# EasyEDA Pro project ProDoc_P1_2026-05-19.epro

# Schematic Schematic1
Assembly Variant: Basic; Board Name: Schematic1; Create Date: 2026-05-19; Page Name: P1; Project Name: STDRIVE101_3Phase_Inverter; Schematic Name: Schematic1; Update Date: 2026-05-19; BladeWidth: 10; Company: 嘉立创EDA; Page Size: A4; RegionStart: 1; ShowBorder: 1; TitleBlock: 0; TitleBlockPosition: 3; Version: V1.0; XRegionCount: 6; YRegionCount: 4
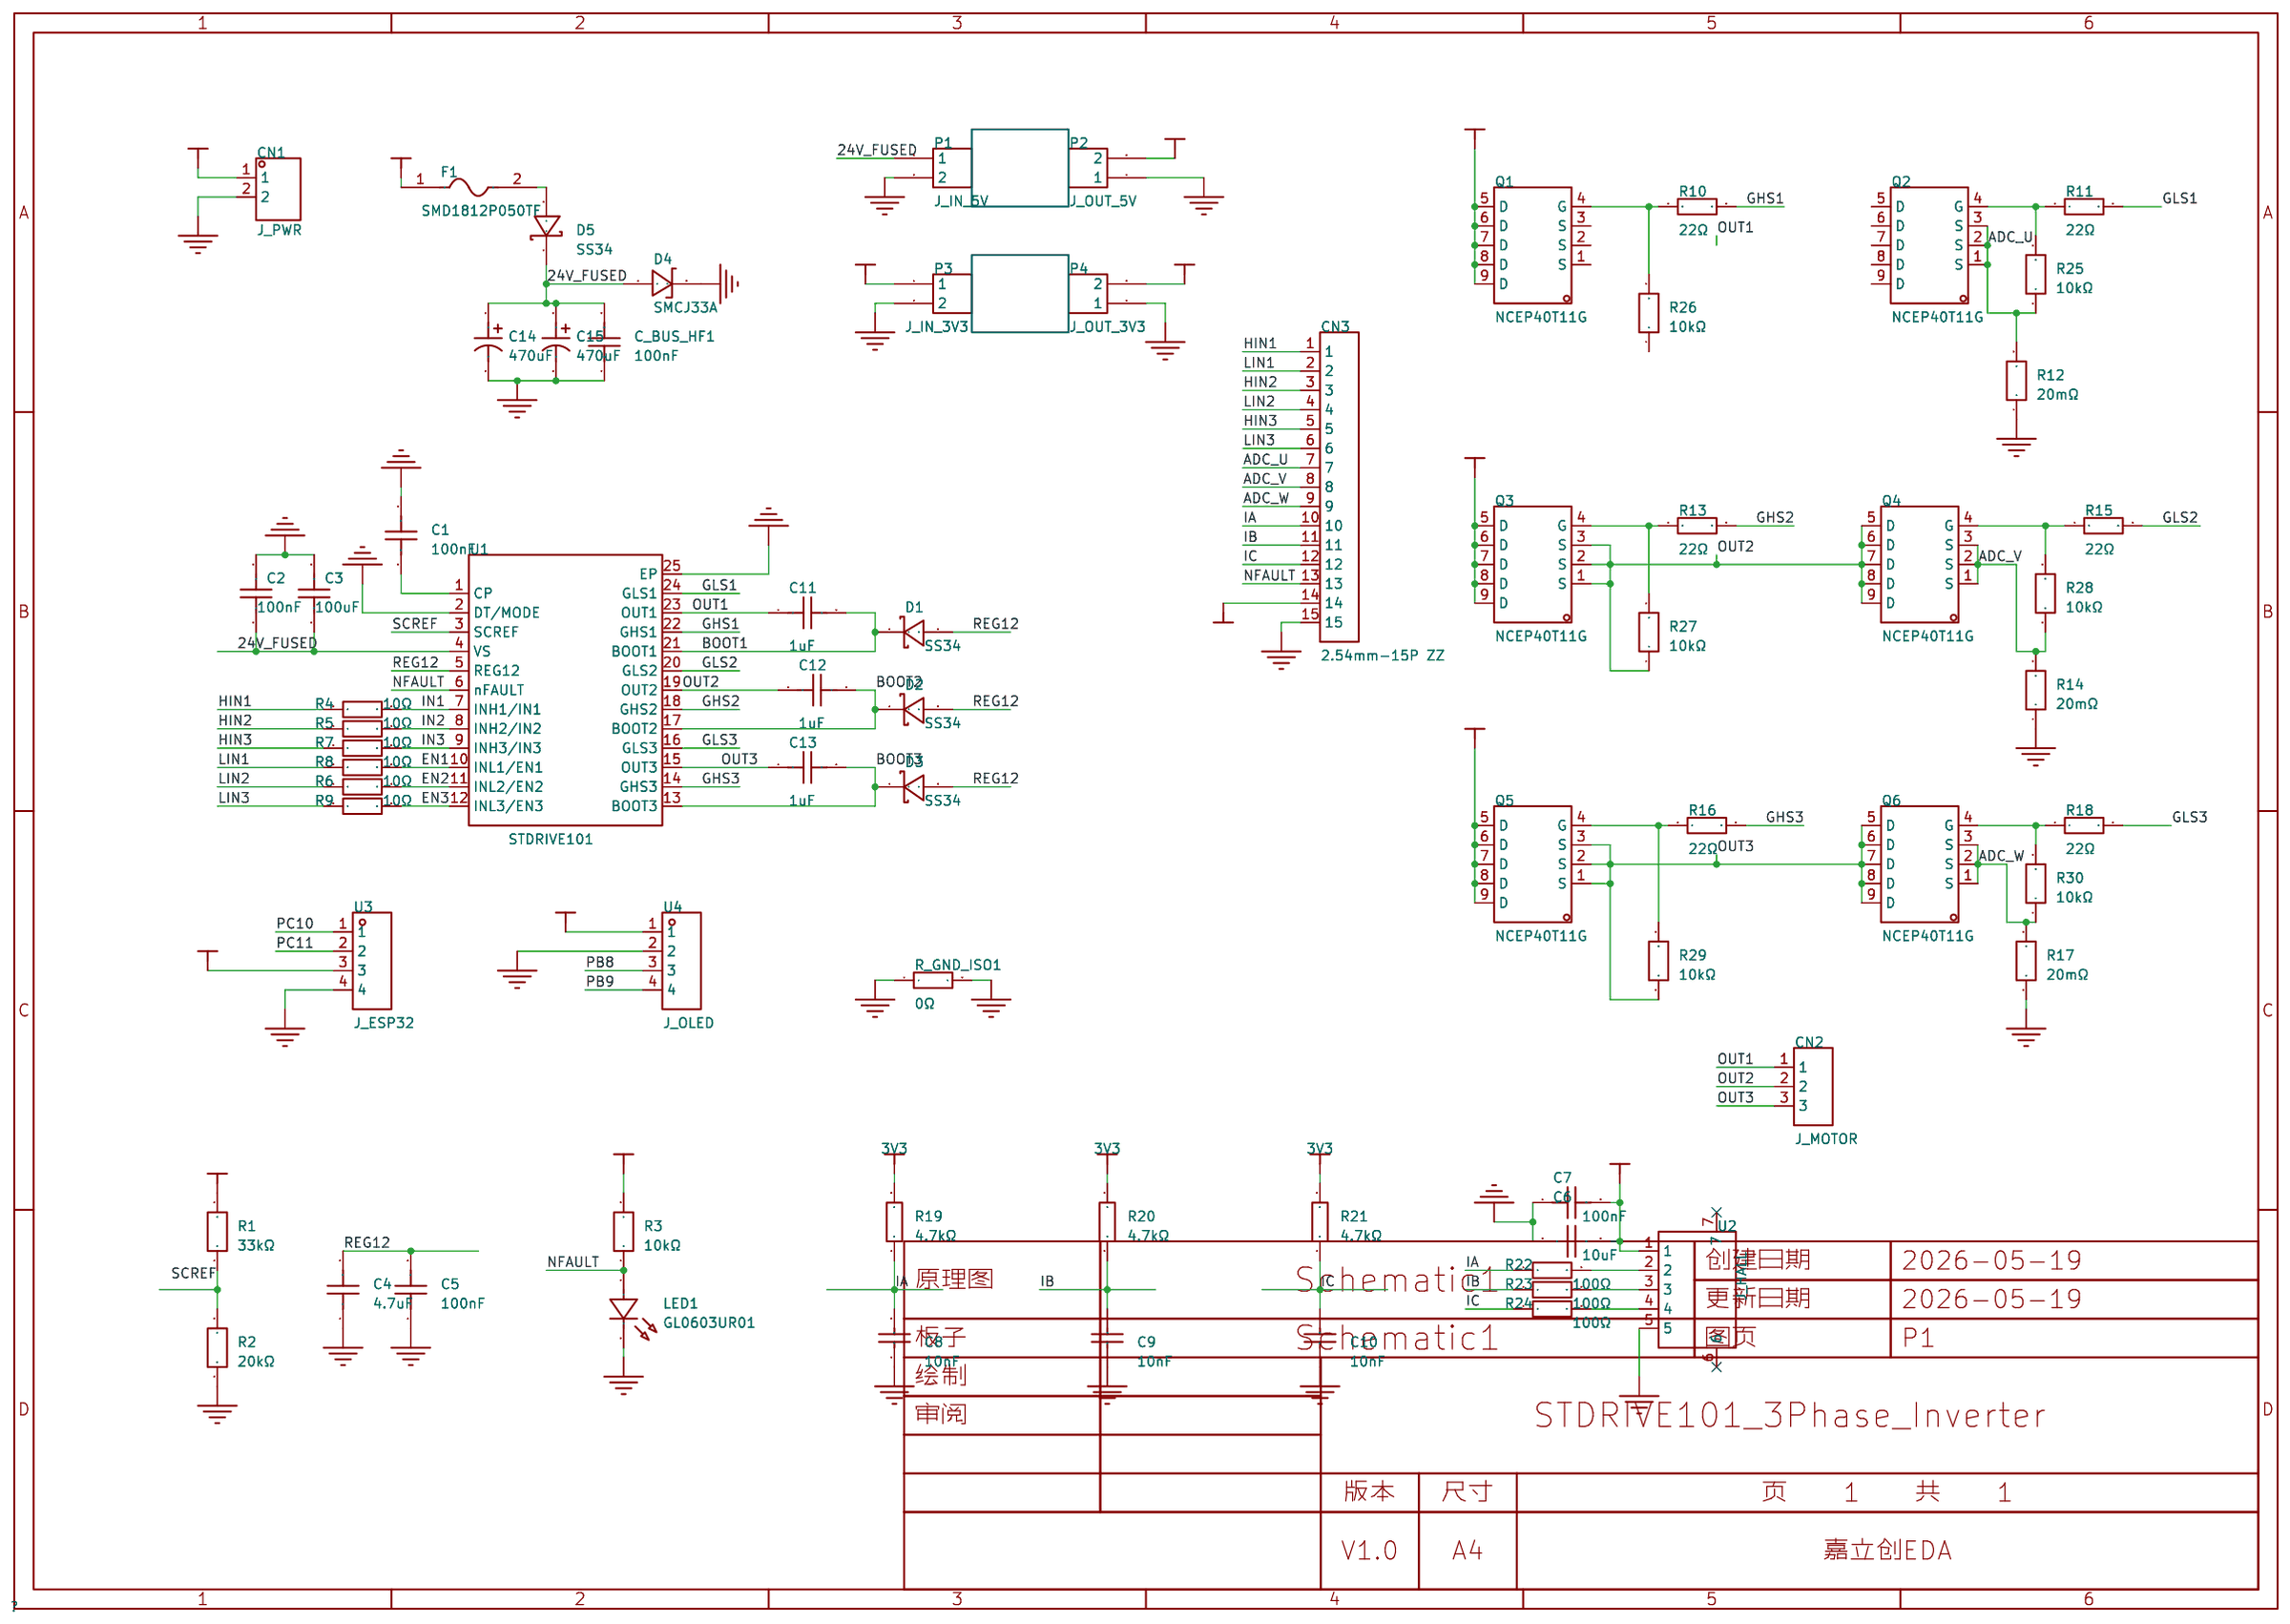
[diagram p0: schematic sheet]

## Parts
C1  100nF  [C0603]
C2  100nF  [C0603]
C3  100uF  [C0603]
C4  4.7uF  [C0603]
C5  100nF  [C0603]
C6  10uF  [C0603]
C7  100nF  [C0603]
C8  10nF  [C0603]
C9  10nF  [C0603]
C10  10nF  [C0603]
C11  1uF  [C0603]
C12  1uF  [C0603]
C13  1uF  [C0603]
C14  470uF  [CAP-TH_BD10.0-P5.00-D0.6-FD-A]
C15  470uF  [CAP-TH_BD10.0-P5.00-D0.6-FD-A]
C_BUS_HF1  100nF  [C0603]
CN1  J_PWR  [CONN-TH_2P-P5.08_LZ1V-5.08-5P-140-00A]
CN2  J_MOTOR  [CONN-TH_3P-MX128-5.08-GN01-03P-CU-Y-A]
CN3  2.54mm-15P ZZ  [CONN-TH_15P-P2.50_HX-2.54MM-15P-ZZ]
D1  SS34  [SMA_L4.3-W2.6-LS5.2-RD]
D2  SS34  [SMA_L4.3-W2.6-LS5.2-RD]
D3  SS34  [SMA_L4.3-W2.6-LS5.2-RD]
D4  SMCJ33A  [SMC_L7.1-W6.2-LS8.1-FD]
D5  SS34  [SMA_L4.3-W2.6-LS5.2-RD]
F1  SMD1812P050TF  [F1812]
LED1  GL0603UR01  [LED0603-FD]
P1  J_IN_5V  [HDR-TH_2P-P2.54-V-M]
P2  J_OUT_5V  [HDR-TH_2P-P2.54-V-M]
P3  J_IN_3V3  [HDR-TH_2P-P2.54-V-M]
P4  J_OUT_3V3  [HDR-TH_2P-P2.54-V-M]
Q1  NCEP40T11G  [DFN-8_L5.1-W5.7-P1.27-LS6.1-BL]
Q2  NCEP40T11G  [DFN-8_L5.1-W5.7-P1.27-LS6.1-BL]
Q3  NCEP40T11G  [DFN-8_L5.1-W5.7-P1.27-LS6.1-BL]
Q4  NCEP40T11G  [DFN-8_L5.1-W5.7-P1.27-LS6.1-BL]
Q5  NCEP40T11G  [DFN-8_L5.1-W5.7-P1.27-LS6.1-BL]
Q6  NCEP40T11G  [DFN-8_L5.1-W5.7-P1.27-LS6.1-BL]
R1  33kΩ  [R0603]
R2  20kΩ  [R0603]
R3  10kΩ  [R0603]
R4  10Ω  [R0603]
R5  10Ω  [R0603]
R6  10Ω  [R0603]
R7  10Ω  [R0603]
R8  10Ω  [R0603]
R9  10Ω  [R0603]
R10  22Ω  [R0603]
R11  22Ω  [R0603]
R12  20mΩ  [R0603]
R13  22Ω  [R0603]
R14  20mΩ  [R0603]
R15  22Ω  [R0603]
R16  22Ω  [R0603]
R17  20mΩ  [R0603]
R18  22Ω  [R0603]
R19  4.7kΩ  [R0603]
R20  4.7kΩ  [R0603]
R21  4.7kΩ  [R0603]
R22  100Ω  [R0603]
R23  100Ω  [R0603]
R24  100Ω  [R0603]
R25  10kΩ  [R0603]
R26  10kΩ  [R0603]
R27  10kΩ  [R0603]
R28  10kΩ  [R0603]
R29  10kΩ  [R0603]
R30  10kΩ  [R0603]
R_GND_ISO1  0Ω  [R0603]
U1  STDRIVE101  [QFN-24_L4.0-W4.0-P0.50-BL-EP2.7]
U2  J_HALL  [CONN-SMD_5P-P2.54_XH2.54-5AB]
U3  J_ESP32  [HDR-TH_4P-P2.54-V-C4_TH-4_2.5X10.5X2.54P]
U4  J_OLED  [HDR-TH_4P-P2.54-V-C4_TH-4_2.5X10.5X2.54P]

## Library data of the parts
C1 C2 C5 C7 C_BUS_HF1 = CGA0603X7R104K500JT: 容值:100nF;精度:±10%;额定电压:50V;温度系数:X7R;; LCSC Part Name: 100nF ±10% 50V; Supplier Part: C6119867; Manufacturer: HRE(芯声); Supplier Footprint: 0603; JLCPCB Part Class: Extended Part; Datasheet: https://item.szlcsc.com/datasheet/CGA0603X7R104K500JT/7062573.html; Supplier: LCSC; Tolerance: ±10%; Voltage Rating: 50V; Temperature Coefficient: X7R
C3 C11-C13 = CAP_0603: Supplier Footprint: 0603
C4 = CGA0603X5R475K250JT: 容值:4.7uF;精度:±10%;额定电压:25V;温度系数:X5R;; LCSC Part Name: 4.7uF ±10% 25V; Supplier Part: C6119856; Manufacturer: HRE(芯声); Supplier Footprint: 0603; JLCPCB Part Class: Extended Part; Datasheet: https://item.szlcsc.com/datasheet/CGA0603X5R475K250JT/7062562.html; Supplier: LCSC; Tolerance: ±10%; Voltage Rating: 25V; Temperature Coefficient: X5R
C6 = CGA0603X5R106K100JT: 容值:10uF;精度:±10%;额定电压:10V;温度系数:X5R;; LCSC Part Name: 10uF ±10% 10V; Supplier Part: C6119842; Manufacturer: HRE(芯声); Supplier Footprint: 0603; JLCPCB Part Class: Extended Part; Datasheet: https://item.szlcsc.com/datasheet/CGA0603X5R106K100JT/7062548.html; Supplier: LCSC; Tolerance: ±10%; Voltage Rating: 10V; Temperature Coefficient: X5R
C8-C10 = CC0603KRX7R9BB103: 容值:10nF;精度:±10%;额定电压:50V;温度系数:X7R;; LCSC Part Name: 10nF ±10% 50V; Supplier Part: C100042; Manufacturer: YAGEO(国巨); Supplier Footprint: 0603; JLCPCB Part Class: Extended Part; Datasheet: https://item.szlcsc.com/datasheet/CC0603KRX7R9BB103/101256.html; Supplier: LCSC; Tolerance: ±10%; Voltage Rating: 50V; Temperature Coefficient: X7R
C14 C15 = PA63V470M10X17: 容值:470uF;精度:±20%;额定电压:63V;纹波电流:4.1A@100kHz;等效串联电阻(ESR):18mΩ@100kHz;类型:聚合物;; LCSC Part Name: 470uF ±20% 63V; Supplier Part: C49232909; Manufacturer: JIERR(捷而瑞); Supplier Footprint: 插件,D10xL17mm; JLCPCB Part Class: Extended Part; Datasheet: https://item.szlcsc.com/datasheet/PA63V470M10X17/51647988.html; Supplier: LCSC; Tolerance: ±20%; Voltage Rating: 63V; Ripple Current: 4.1A@100kHz; Equivalent Series Resistance(ESR): 18mΩ@100kHz; Type: 聚合物; Pin Spacing: 5mm; Diameter: 10mm; Height - Seated (Max): 17mm; Lifetime: 2000hrs@105℃; Operating Temperature: -55℃~+105℃
CN1 = LZ1V-5.08-5P-140-00A: Supplier Part: C9900004323; Supplier Footprint: TH-2_P=5.08mm; JLCPCB Part Class: Extended Part; Supplier: LCSC
CN2 = MX128-5.08-3P: Supplier Part: C9900216095; Supplier Footprint: 插件,P=5.08mm,3P; JLCPCB Part Class: Extended Part; Supplier: LCSC
CN3 = 2.54mm-15P ZZ: 插针结构:1x15P;间距:2.5mm;安装方式:直插;参考系列:XH;总PIN数:15P;排数:1;每排PIN数:15;行距:-;额定电流:3A;触头材质:黄铜;触头镀层:锡;工作温度:-25℃~+85℃;; LCSC Part Name: 2.54-15P直针 白色不耐温; Supplier Part: C5368787; Manufacturer: SHOU HAN(首韩); Supplier Footprint: 插件,P=2.5mm; JLCPCB Part Class: Extended Part; Datasheet: https://item.szlcsc.com/datasheet/2.54mm-15P%2520ZZ/6208429.html; Supplier: LCSC; Pins Structure: 1x15P; Pitch: 2.5mm; Mounting Type: 直插; Reference Series: XH; Number of Pins: 15P; Number of Rows: 1; Number of PINs Per Row: 15; Current Rating: 3A; Contact Material: 黄铜; Contact Plating: 锡; Operating Temperature: -25℃~+85℃; Voltage Rating: 250V; Plastic Material: PA66; Flame Retardant Rating: UL94V-0; Color: 白色
D1-D3 D5 = SS34_C8678: 二极管配置:独立式;正向压降(Vf):550mV@3A;直流反向耐压(Vr):40V;整流电流:3A;; LCSC Part Name: 电压:40V 电流:3A; Supplier Part: C8678; Manufacturer: MDD(辰达半导体); Supplier Footprint: SMA(DO-214AC); JLCPCB Part Class: Basic Part; Datasheet: https://item.szlcsc.com/datasheet/SS34/9178.html; Supplier: LCSC; Diode Configuration: 独立式; Voltage - Forward(Vf@If): 550mV@3A; Voltage - DC Reverse(Vr): 40V; Current - Rectified: 3A; Reverse Leakage Current (Ir): 500uA@40V; Operating Junction Temperature Range: -55℃~+125℃
D4 = SMCJ33A: 反向截止电压(Vrwm):33V;最大钳位电压:53.3V;峰值脉冲电流(Ipp):28.2A;击穿电压:36.7V;; Supplier Part: C356786; Manufacturer: JJW(捷捷微); Supplier Footprint: SMC(DO-214AB); JLCPCB Part Class: Extended Part; Datasheet: https://atta.szlcsc.com/upload/public/pdf/source/20181226/C356793_C1FF0BB4994669FE0B6214A04E00432E.pdf; Supplier: LCSC; Reverse Stand-Off Voltage (Vrwm): 33V; Maximum Clamping Voltage: 53.3V; Peak Pulse Current (Ipp): 28.2A; Breakdown Voltage: 36.7V; Type: TVS
F1 = SMD1812P050TF: 耐压(Vmax):15V;最大电流(Imax):30A;保持电流(Ihold):500mA;跳闸电流(Itrip):1A;; LCSC Part Name: 15V 500mA 1812自恢复; Supplier Part: C12558; Manufacturer: RUILON(瑞隆源); Supplier Footprint: 1812; JLCPCB Part Class: Extended Part; Datasheet: https://item.szlcsc.com/datasheet/SMD1812P050TF/13192.html; Supplier: LCSC; Voltage - Max: 15V; Current - Max: 30A; Hold Current: 500mA; Trip Current: 1A; Power Dissipation: 800mW; Resistance - Initial (Ri) (Min): 150mΩ; Resistance - Post Trip (R1) (Max): 1Ω; Time to Trip(Max): 150ms; Operating Temperature: -40℃~+85℃; Length: 4.73mm; Width: 3.41mm; Height: 1mm
LED1 = GL0603UR01: 发光颜色:红色;正向压降(Vf):2.4V;正向电流:20mA;波长:620nm~625nm;二极管配置:独立二极管;透镜颜色:无色透明透镜;发光强度:120mcd;发光角度:120°;载带方式:正贴;工作温度:-40℃~+85℃;; LCSC Part Name: 0603 红灯 高亮; Supplier Part: C51933292; Manufacturer: Guiguang light(桂光光电); Supplier Footprint: 0603; JLCPCB Part Class: Extended Part; Datasheet: https://item.szlcsc.com/datasheet/GL0603UR01/54645988.html; Supplier: LCSC; Illumination Color: 红色; Voltage - Forward(Vf): 2.4V; Forward Current: 20mA; Wavelength - Dominant: 620nm~625nm; Diode Configuration: 独立二极管; Lens Color: 无色透明透镜; Luminous Intensity: 120mcd; Viewing Angle: 120°; Mounting Style: 正贴; Operating Temperature: -40℃~+85℃
P1-P4 = 2.54mm 1*2P: 圆针/方针:-;额定电流:-;额定电压:-;配合针长度:-;塑高:-;触头材质:-;; LCSC Part Name: 2.54mm   1*2P; Supplier Part: C36717; Supplier Footprint: P=2.54mm; JLCPCB Part Class: Extended Part; Supplier: LCSC
Q1-Q6 = NCEP40T11G: 数量:1个N沟道;漏源电压(Vdss):40V;连续漏极电流(Id):110A;导通电阻(RDS(on)):3.9mΩ@4.5V,55A;耗散功率(Pd):75W;阈值电压(Vgs(th)):2.2V@250uA;; LCSC Part Name: 1个N沟道 耐压:40V 电流:110A; Supplier Part: C182465; Manufacturer: NCE(无锡新洁能); Supplier Footprint: DFN5X6-8L; JLCPCB Part Class: Extended Part; Datasheet: https://item.szlcsc.com/datasheet/NCEP40T11G/193865.html; Supplier: LCSC; Number: 1个N沟道; Drain to Source Voltage: 40V; Current - Continuous Drain(Id): 110A; RDS(on): 3.9mΩ@4.5V,55A; Pd - Power Dissipation: 75W; Gate Threshold Voltage (Vgs(th)): 2.2V@250uA; Gate Charge(Qg): 72nC@10V; Input Capacitance(Ciss): 4.2nF; Reverse Transfer Capacitance (Crss@Vds): 78pF; Operating Temperature: -55℃~+150℃; Type: N沟道; Output Capacitance(Coss): 1nF
R1 = FRC0603F3302TS: 电阻类型:厚膜电阻;阻值:33kΩ;精度:±1%;功率:100mW;工作电压:75V;温度系数:±100ppm/℃;; LCSC Part Name: 33kΩ ±1% 100mW 厚膜电阻; Supplier Part: C2907028; Manufacturer: FOJAN(富捷); Supplier Footprint: 0603; JLCPCB Part Class: Extended Part; Supplier: LCSC; Type: 厚膜电阻; Tolerance: ±1%; Power(Watts): 100mW; Voltage-Supply(Max): 75V; Temperature Coefficient: ±100ppm/℃; Operating Temperature: -55℃~+155℃
R2 = FRC0603F2002TS: 电阻类型:厚膜电阻;阻值:20kΩ;精度:±1%;功率:100mW;工作电压:75V;温度系数:±100ppm/℃;; LCSC Part Name: 20kΩ ±1% 100mW 厚膜电阻; Supplier Part: C2907011; Manufacturer: FOJAN(富捷); Supplier Footprint: 0603; JLCPCB Part Class: Extended Part; Supplier: LCSC; Type: 厚膜电阻; Tolerance: ±1%; Power(Watts): 100mW; Voltage-Supply(Max): 75V; Temperature Coefficient: ±100ppm/℃; Operating Temperature: -55℃~+155℃
R3 R25-R30 = FRC0603F1002TS: 电阻类型:厚膜电阻;阻值:10kΩ;精度:±1%;功率:100mW;工作电压:75V;温度系数:±100ppm/℃;; LCSC Part Name: 10kΩ ±1% 100mW 厚膜电阻; Supplier Part: C2906982; Manufacturer: FOJAN(富捷); Supplier Footprint: 0603; JLCPCB Part Class: Extended Part; Supplier: LCSC; Type: 厚膜电阻; Tolerance: ±1%; Power(Watts): 100mW; Voltage-Supply(Max): 75V; Temperature Coefficient: ±100ppm/℃; Operating Temperature: -55℃~+155℃
R4-R9 = 0603WAF100JT5E: 电阻类型:厚膜电阻;阻值:10Ω;精度:±1%;功率:100mW;工作电压:75V;温度系数:±400ppm/℃;; LCSC Part Name: 10Ω ±1% 100mW 厚膜电阻; Supplier Part: C22859; Manufacturer: UNI-ROYAL(厚声); Supplier Footprint: 0603; JLCPCB Part Class: Basic Part; Datasheet: https://item.szlcsc.com/datasheet/0603WAF100JT5E/23586.html; Supplier: LCSC; Type: 厚膜电阻; Tolerance: ±1%; Power(Watts): 100mW; Voltage-Supply(Max): 75V; Temperature Coefficient: ±400ppm/℃; Operating Temperature: -55℃~+155℃
R10 R11 R13 R15 R16 R18 = 0603WAJ0220T5E: 电阻类型:厚膜电阻;阻值:22Ω;精度:±5%;功率:100mW;最大工作电压:75V;温度系数:±200ppm/℃;; LCSC Part Name: 22Ω ±5% 100mW 厚膜电阻; Supplier Part: C1203; Manufacturer: UNI-ROYAL(厚声); Supplier Footprint: 0603; JLCPCB Part Class: Extended Part; Datasheet: https://atta.szlcsc.com/upload/public/pdf/source/20200306/C422600_1E6D84923E4A46A82E41ADD87F860B5C.pdf; Supplier: LCSC; Type: 厚膜电阻; Tolerance: ±5%; Power(Watts): 100mW; Overload Voltage (Max): 75V; Temperature Coefficient: ±200ppm/℃; Operating Temperature Range: -55℃~+155℃
R12 R14 R17 = HoYH0603-1/2W-20mR-1%: 电阻类型:采样电阻;阻值:20mΩ;精度:±1%;功率:500mW;安装方式:贴片;; LCSC Part Name: 20mΩ ±1% 500mW; Supplier Part: C2912775; Manufacturer: Milliohm(毫欧); Supplier Footprint: 0603; JLCPCB Part Class: Extended Part; Datasheet: https://item.szlcsc.com/datasheet/HoYH0603-1%252F2W-20mR-1%2525/3195638.html; Supplier: LCSC; Type: 采样电阻; Tolerance: ±1%; Power(Watts): 500mW; Mounting Type: 贴片
R19-R21 = RC0603FR-074K7L: 电阻类型:厚膜电阻;阻值:4.7kΩ;精度:±1%;功率:100mW;工作电压:75V;温度系数:±100ppm/℃;; LCSC Part Name: 厚膜电阻 4.7kΩ ±1% 100mW; Supplier Part: C99782; Manufacturer: YAGEO(国巨); Supplier Footprint: 0603; JLCPCB Part Class: Extended Part; Datasheet: https://item.szlcsc.com/datasheet/RC0603FR-074K7L/100996.html; Supplier: LCSC; Type: 厚膜电阻; Tolerance: ±1%; Power(Watts): 100mW; Voltage-Supply(Max): 75V; Temperature Coefficient: ±100ppm/℃; Operating Temperature: -55℃~+155℃
R22-R24 = RC0603FR-07100RL: 电阻类型:厚膜电阻;阻值:100Ω;精度:±1%;功率:100mW;最大工作电压:75V;温度系数:±100ppm/℃;; LCSC Part Name: 厚膜电阻 100Ω ±1% 100mW; Supplier Part: C105588; Manufacturer: YAGEO(国巨); Supplier Footprint: 0603; JLCPCB Part Class: Extended Part; Datasheet: https://atta.szlcsc.com/upload/public/pdf/source/20180316/70C0E2BDAE7FCC62C531A5A58D202EE1.pdf; Supplier: LCSC; Type: 厚膜电阻; Tolerance: ±1%; Power(Watts): 100mW; Overload Voltage (Max): 75V; Temperature Coefficient: ±100ppm/℃; Operating Temperature Range: -55℃~+155℃
R_GND_ISO1 = Res_0603: Supplier Footprint: 0603
U1 = STDRIVE101: 驱动配置:半桥;负载类型:MOSFET;驱动通道数:3;灌电流(IOL):600mA;拉电流(IOH):600mA;工作电压:5.5V~75V;上升时间(tr):-;下降时间(tf):-;; LCSC Part Name: 三路半桥栅极驱动器; Supplier Part: C2969847; Manufacturer: ST(意法半导体); Supplier Footprint: VFQFPN-24(4x4); JLCPCB Part Class: Extended Part; Datasheet: https://item.szlcsc.com/datasheet/STDRIVE101/3362311.html; Supplier: LCSC; Driven Configuration: 半桥; Load Type: MOSFET; Number of Drivers: 3; Current - Output Low(IOL): 600mA; Current - Output High(IOH): 600mA; Voltage - Supply: 5.5V~75V; Features: 欠压保护(UVP)；过流保护(OCP)；过热保护(OTP); Operating Temperature: -40℃~+125℃; Input Logic Level - High: 2V~5V; Input Logic Level - Low: 0V~800mV; Quiescent Current(Iq): 1.7mA
U2 = MX2.54-LS-5P: Supplier Part: C9900012751; Supplier Footprint: 2.545PIN立式带扣端子; JLCPCB Part Class: Extended Part; Supplier: LCSC
U3 U4 = 单排直插排针 1*4P 2.54mm: Supplier Part: C2887121; Supplier Footprint: TH-4_2.5X10.5X2.54P; JLCPCB Part Class: Extended Part; Supplier: LCSC

## Nets
3V3: CN3.14 P4.2 R1.2 R3.2 R19.2 R20.2 R21.2 U3.3 U4.1
24V: CN1.1 F1.1
24V_FUSED: C2.1 C3.1 C14.1 C15.1 C_BUS_HF1.2 D4.1(A) D5.1(K) P1.1 Q1.5(D) Q1.6(D) Q1.7(D) Q1.8(D) Q1.9(D) Q3.5(D) Q3.6(D) Q3.7(D) Q3.8(D) Q3.9(D) Q5.5(D) Q5.6(D) Q5.7(D) Q5.8(D) Q5.9(D) U1.4(VS)
+5V: C6.2 C7.2 P2.2 P3.1 U2.1
GND_POWER: C1.1 C2.2 C3.2 C14.2 C15.2 C_BUS_HF1.1 CN1.2 D4.2(K) P1.2 P2.1 P3.2 P4.1 R12.1 R14.1 R17.1 R_GND_ISO1.1 U1.2(DT/MODE) U1.25(EP)
GND_SIGNAL: C4.1 C5.1 C6.1 C7.1 C8.1 C9.1 C10.1 CN3.15 LED1.2(C) R2.1 R_GND_ISO1.2 U2.5 U3.4 U4.2
ADC_U: CN3.7 Q2.1(S) Q2.2(S) Q2.3(S) R12.2 R25.1
ADC_V: CN3.8 Q4.1(S) Q4.2(S) Q4.3(S) R14.2 R28.1
ADC_W: CN3.9 Q6.1(S) Q6.2(S) Q6.3(S) R17.2 R30.1
BOOT1: C11.2 D1.1(K) U1.21(BOOT1)
BOOT2: C12.2 D2.1(K) U1.17(BOOT2)
BOOT3: C13.2 D3.1(K) U1.13(BOOT3)
EN1: R8.2 U1.10(INL1/EN1)
EN2: R6.2 U1.11(INL2/EN2)
EN3: R9.2 U1.12(INL3/EN3)
GHS1: R10.2 U1.22(GHS1)
GHS2: R13.2 U1.18(GHS2)
GHS3: R16.2 U1.14(GHS3)
GLS1: R11.2 U1.24(GLS1)
GLS2: R15.2 U1.20(GLS2)
GLS3: R18.2 U1.16(GLS3)
HIN1: CN3.1 R4.1
HIN2: CN3.3 R5.1
HIN3: CN3.5 R7.1
IA: C8.2 CN3.10 R19.1 R22.1
IB: C9.2 CN3.11 R20.1 R23.1
IC: C10.2 CN3.12 R21.1 R24.1
IN1: R4.2 U1.7(INH1/IN1)
IN2: R5.2 U1.8(INH2/IN2)
IN3: R7.2 U1.9(INH3/IN3)
LIN1: CN3.2 R8.1
LIN2: CN3.4 R6.1
LIN3: CN3.6 R9.1
NFAULT: CN3.13 LED1.1(A) R3.1 U1.6(nFAULT)
OUT1: C11.1 CN2.1 Q1.1(S) Q1.2(S) Q1.3(S) Q2.5(D) Q2.6(D) Q2.7(D) Q2.8(D) Q2.9(D) R26.1 U1.23(OUT1)
OUT2: C12.1 CN2.2 Q3.1(S) Q3.2(S) Q3.3(S) Q4.5(D) Q4.6(D) Q4.7(D) Q4.8(D) Q4.9(D) R27.1 U1.19(OUT2)
OUT3: C13.1 CN2.3 Q5.1(S) Q5.2(S) Q5.3(S) Q6.5(D) Q6.6(D) Q6.7(D) Q6.8(D) Q6.9(D) R29.1 U1.15(OUT3)
PB8: U4.3
PB9: U4.4
PC10: U3.1
PC11: U3.2
REG12: C4.2 C5.2 D1.2(A) D2.2(A) D3.2(A) U1.5(REG12)
SCREF: R1.1 R2.2 U1.3(SCREF)
Net-(C1-2): C1.2 U1.1(CP)
Net-(D5-2): D5.2(A) F1.2
Net-(Q1-4): Q1.4(G) R10.1 R26.2
Net-(Q2-4): Q2.4(G) R11.1 R25.2
Net-(Q3-4): Q3.4(G) R13.1 R27.2
Net-(Q4-4): Q4.4(G) R15.1 R28.2
Net-(Q5-4): Q5.4(G) R16.1 R29.2
Net-(Q6-4): Q6.4(G) R18.1 R30.2
Net-(R22-2): R22.2 U2.2
Net-(R23-2): R23.2 U2.3
Net-(R24-2): R24.2 U2.4

Not connected (* = marked no-connect by the designer): U2 6* 7*
